# Altium project dxp.PrjPcb (part 2 of 2)

## Sheet DRV8313EVM.SchDoc
size A4
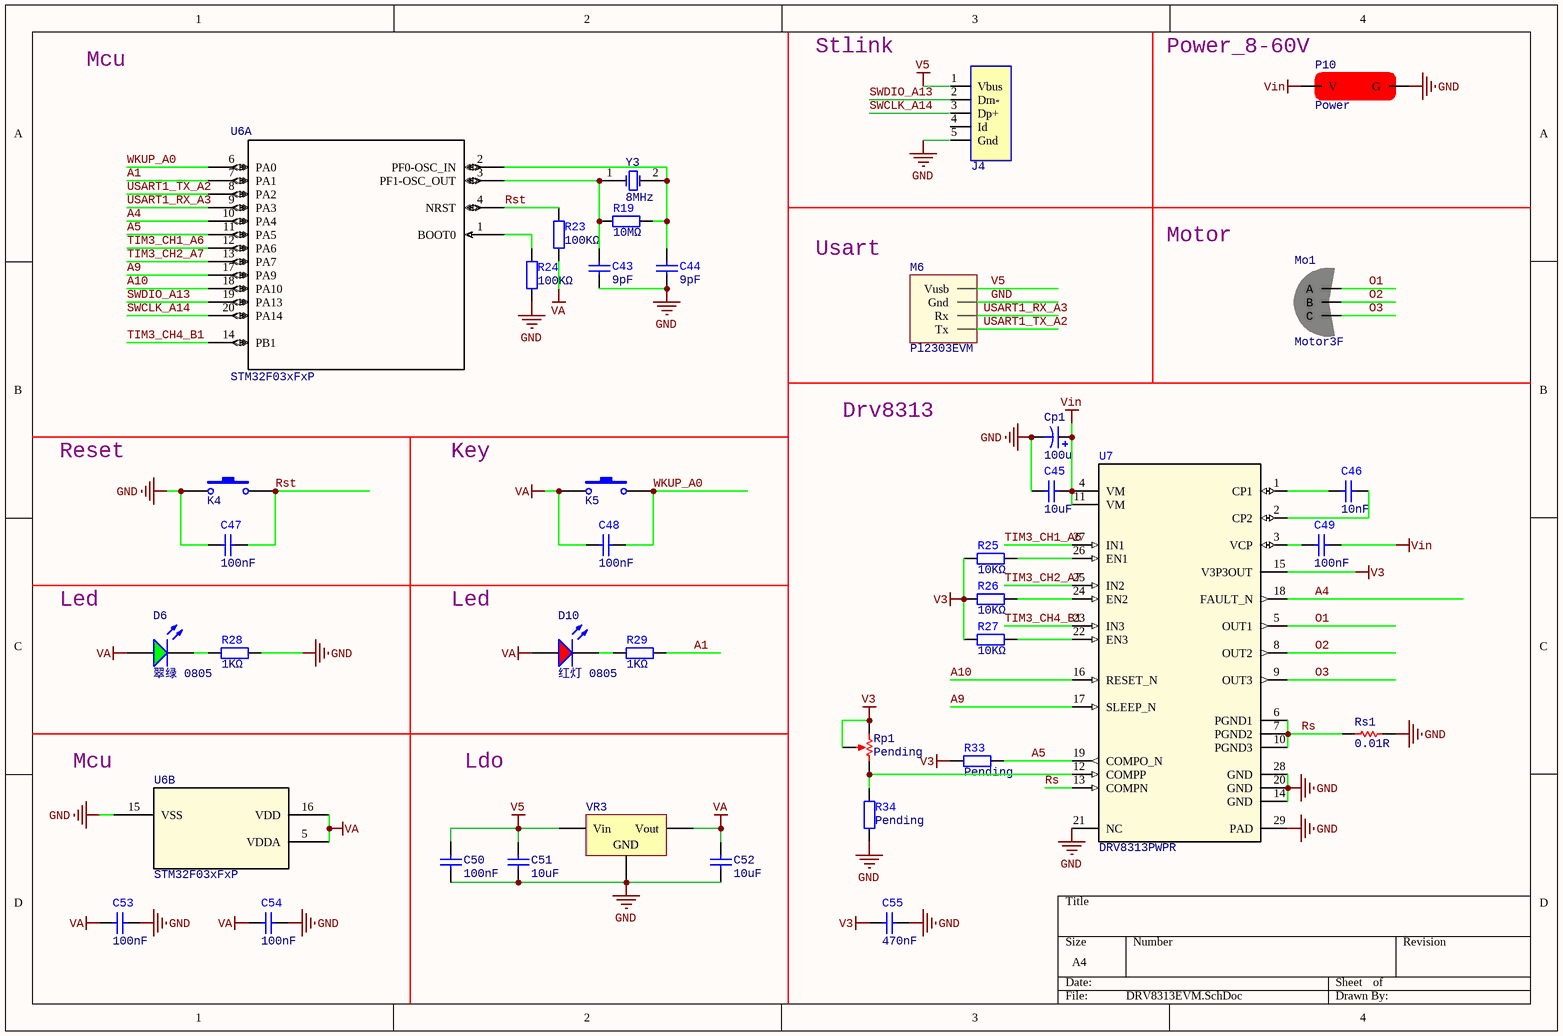
[diagram p8: DRV8313EVM.SchDoc]

### Parts
(Parts that share a designator on the sheet are numbered #1, #2 ... from top to bottom, then left to right.)
C43  9pF  [0805_C]
C44  9pF  [0805_C]
C45  10uF  [0805_C]
C46  10nF  [0805_C]
C47  100nF  [0805_C]
C48  100nF  [0805_C]
C49  100nF  [0805_C]
C50  100nF  [0805_C]
C51  10uF  [0805_C]
C52  10uF  [0805_C]
C53  100nF  [0805_C]
C54  100nF  [0805_C]
C55  470nF  [0805_C]
Cp1  100u  [CM D(6.3*5.4)]
D6  翠绿 0805  [0805_LED_S1]
D10  红灯 0805  [0805_LED_S1]
J4#2  UsbOtg  [USB-MINI-A]  (value not drawn)
K4  SW  [SWITCH]  (value not drawn)
K5  SW  [SWITCH]  (value not drawn)
M6#1  Pl2303EVM  [PI230203EVM]
Mo1  Motor3F  [Motor_3F]
P10  Power  [DC-005]
R19#2  10MΩ  [0805_R]
R23  100KΩ  [0805_R]
R24  100KΩ  [0805_R]
R25  10KΩ  [0805_R]
R26  10KΩ  [0805_R]
R27  10KΩ  [0805_R]
R28  1KΩ  [0805_R]
R29  1KΩ  [0805_R]
R33  Pending  [0805_R]
R34  Pending  [0805_R]
Rp1#1  Pending  [RP3362P]
Rs1#1  0.01R  [R 2512_L]
U6  STM32F03xFxP  [TSSOP20]  (parts A,B of 2)
U7  DRV8313PWPR  [PWP0028F_L]
VR3#1  AMS1117-3.3  [SOT-223]  (value not drawn)
Y3  8MHz  [XTAL_US]

### Nets
GND: C43.1 C44.1 C45.1 C47.2 C50.1 C51.1 C52.1 C53.1 C54.1 C55.2 Cp1.2 J4#2.5(Gnd) K4.1 M6#1.2(Gnd) P10.2(G) R24.1 R28.1 R34.1 Rs1#1.2 U6.15(VSS) U7.14(GND) U7.20(GND) U7.21(NC) U7.28(GND) U7.29(PAD) VR3#1.1(GND)
V3: C55.1 R25.1 R26.1 R27.1 R33.2 Rp1#1.2(TAP) Rp1#1.3(TOP) U7.15(V3P3OUT)
V5: C50.2 C51.2 J4#2.1(Vbus) M6#1.1(Vusb) VR3#1.3(Vin)
VA: C48.2 C52.2 C53.2 C54.2 D6.A D10.A K5.1 R23.1 U6.5(VDDA) U6.16(VDD) VR3#1.2(Vout)
Vin: C45.2 C49.2 Cp1.1 P10.1(V) U7.4(VM) U7.11(VM)
A1: R29.1 U6.7(PA1)
A4: U6.10(PA4) U7.18(FAULT_N)
A5: R33.1 U6.11(PA5) U7.19(COMPO_N)
A9: U6.17(PA9) U7.17(SLEEP_N)
A10: U6.18(PA10) U7.16(RESET_N)
O1: Mo1.1(A) U7.5(OUT1)
O2: Mo1.2(B) U7.8(OUT2)
O3: Mo1.3(C) U7.9(OUT3)
Rs: Rs1#1.1 U7.6(PGND1) U7.7(PGND2) U7.10(PGND3) U7.13(COMPN)
Rst: C47.1 K4.2 R23.2 U6.4(NRST)
SWCLK_A14: J4#2.3(Dp+) U6.20(PA14)
SWDIO_A13: J4#2.2(Dm-) U6.19(PA13)
TIM3_CH1_A6: U6.12(PA6) U7.27(IN1)
TIM3_CH2_A7: U6.13(PA7) U7.25(IN2)
TIM3_CH4_B1: U6.14(PB1) U7.23(IN3)
USART1_RX_A3: M6#1.3(Rx) U6.9(PA3)
USART1_TX_A2: M6#1.4(Tx) U6.8(PA2)
WKUP_A0: C48.1 K5.2 U6.6(PA0)
NetC43_2: C43.2 R19#2.1 U6.3(PF1-OSC_OUT) Y3.1(OSC1)
NetC44_2: C44.2 R19#2.2 U6.2(PF0-OSC_IN) Y3.2(OSC2)
NetC46_1: C46.1 U7.1(CP1)
NetC46_2: C46.2 U7.2(CP2)
NetC49_1: C49.1 U7.3(VCP)
NetD6_K: D6.K R28.2
NetD10_K: D10.K R29.2
NetR24_2: R24.2 U6.1(BOOT0)
NetR25_2: R25.2 U7.26(EN1)
NetR26_2: R26.2 U7.24(EN2)
NetR27_2: R27.2 U7.22(EN3)
NetR34_2: R34.2 Rp1#1.1(BOT) U7.12(COMPP)

Not connected (* = marked no-connect by the designer): J4#2 4(Id)

### Notes on the sheet
- Mcu
- Stlink
- (near P10) Power_8-60V
- Motor
- Usart
- Drv8313
- Reset
- Key
- Led
- Ldo

### Library data of the parts
C43-C49 C53-C55 = 0805 10nF (103) 10% 50V: 贴片电容; ComponentLink1Description: 供应商链接; ComponentLink1URL: http://www.szlcsc.com/product/details_2062.html; Package: 0805; Supplier: LC; SuppliersPartNumber: C1710
C50-C52 = 0805 10uF (106) 10% 25V: 贴片电容; ComponentLink1Description: 供应商链接; ComponentLink1URL: http://www.szlcsc.com/product/details_16532.html; Package: 0805; Supplier: LC; SuppliersPartNumber: C15850
Cp1 = Cp: Polarized Capacitor (Axial); Published: 8-Jun-2000; LatestRevisionDate: 17-Jul-2002; LatestRevisionNote: Re-released for DXP Platform.; PackageReference: POLAR0.8; Publisher: Altium Limited; PackageDescription: Polarized Capacitor; 2 Leads
D6 = 0805 翠绿: 发光二极管; ComponentLink1Description: 供应商链接; ComponentLink1URL: http://www.szlcsc.com/product/details_2670.html; Package: 0805; Supplier: LC; SuppliersPartNumber: C2297
D10 = 0805 红灯: 发光二极管; ComponentLink1Description: 供应商链接; ComponentLink1URL: http://www.szlcsc.com/product/details_2668.html; Package: 0805; Supplier: LC; SuppliersPartNumber: C2295
K4 K5 = SW: Switch
R19#2 R23-R29 R33 R34 = 0805 10KΩ (1002) 1%: 贴片电阻; ComponentLink1Description: 供应商链接; ComponentLink1URL: http://www.szlcsc.com/product/details_18102.html; Package: 0805; Supplier: LC; SuppliersPartNumber: C17414
Rp1#1 = Rp: Potentiometer; Sim Note: Enter the Resistance value and the set point into parameter fields.; Set Position: 0.5; Published: 8-Jun-2000; LatestRevisionDate: 17-Jul-2002; LatestRevisionNote: Re-released for DXP Platform.; PackageReference: VR5; Publisher: Altium Limited; PackageDescription: Variable Resistor, Thru-Hole; 3 Leads
Rs1#1 = Rs
U6 = STM32F03xFxP: Mcu; Vendor: STMicroelectronics; C: Copyright (C) 2016 Accelerated Designs. All rights reserved; Copyright: Copyright (C) 2016 Accelerated Designs. All rights reserved; Manufacturer_Part_Number: stm32f03xfxp; RefDes: RefDes; Type: Type; Value: Value
U7 = DRV8313PWPR: Imported; Manufacturer: Texas Instruments; PartNumber: DRV8313PWPR; RefDes: RefDes; TYPE: TYPE; Value: Value
VR3#1 = SOT-223 AMS1117-3.3: 低压差线性稳压(LDO); ComponentLink1Description: 供应商链接; ComponentLink1URL: http://www.szlcsc.com/product/details_6652.html; Package: SOT-223; Supplier: LC; SuppliersPartNumber: C6186
Y3 = XTAL: Crystal Oscillator; Published: 8-Jun-2000; LatestRevisionDate: 17-Jul-2002; LatestRevisionNote: Re-released for DXP Platform.; Publisher: Altium Limited

## Sheet MPU6050EVM.SchDoc
size A4
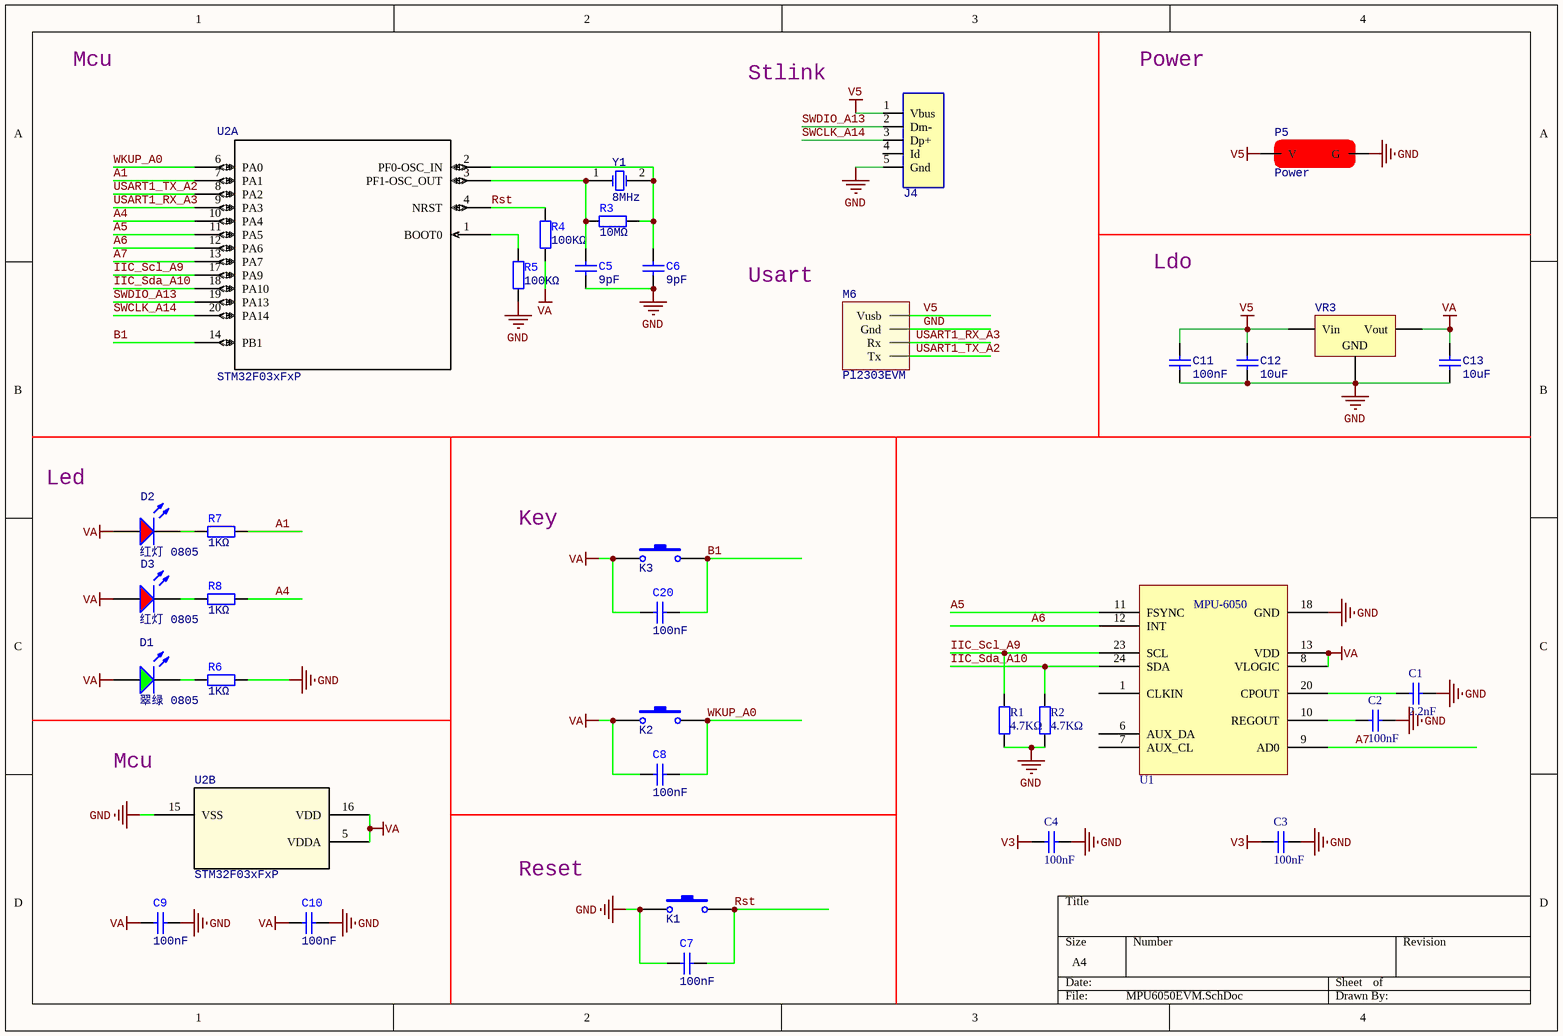
[diagram p9: MPU6050EVM.SchDoc]

### Parts
(Parts that share a designator on the sheet are numbered #1, #2 ... from top to bottom, then left to right.)
C1#7  2.2nF  [0805_C]
C2#8  100nF  [0805_C]
C3#7  100nF  [0805_C]
C4#7  100nF  [0805_C]
C5#5  9pF  [0805_C]
C6#5  9pF  [0805_C]
C7#5  100nF  [0805_C]
C8#5  100nF  [0805_C]
C9#4  100nF  [0805_C]
C10#4  100nF  [0805_C]
C11#4  100nF  [0805_C]
C12#4  10uF  [0805_C]
C13#4  10uF  [0805_C]
C20#2  100nF  [0805_C]
D1#6  翠绿 0805  [0805_LED_S1]
D2#4  红灯 0805  [0805_LED_S1]
D3#2  红灯 0805  [0805_LED_S1]
J4#3  UsbOtg  [USB-MINI-A]  (value not drawn)
K1#2  SW  [SWITCH]  (value not drawn)
K2#2  SW  [SWITCH]  (value not drawn)
K3#2  SW  [SWITCH]  (value not drawn)
M6#2  Pl2303EVM  [PI230203EVM]
P5#2  Power  [DC-005]
R1#7  4.7KΩ  [0805_R]
R2#6  4.7KΩ  [0805_R]
R3#6  10MΩ  [0805_R]
R4#6  100KΩ  [0805_R]
R5#5  100KΩ  [0805_R]
R6#4  1KΩ  [0805_R]
R7#3  1KΩ  [0805_R]
R8#4  1KΩ  [0805_R]
U1#7  MPU6050  [QFN24 4x4_L]  (value not drawn)
U2#7  STM32F03xFxP  [TSSOP20]  (parts A,B of 2)
VR3#2  AMS1117-3.3  [SOT-223]  (value not drawn)
Y1#5  8MHz  [XTAL_US]

### Nets
GND: C1#7.2 C2#8.1 C3#7.2 C4#7.2 C5#5.1 C6#5.1 C7#5.2 C9#4.1 C10#4.1 C11#4.1 C12#4.1 C13#4.1 J4#3.5(Gnd) K1#2.1 M6#2.2(Gnd) P5#2.2(G) R1#7.1 R2#6.1 R5#5.1 R6#4.1 U1#7.18(GND) U2#7.15(VSS) VR3#2.1(GND)
V3: C3#7.1 C4#7.1
V5: C11#4.2 C12#4.2 J4#3.1(Vbus) M6#2.1(Vusb) P5#2.1(V) VR3#2.3(Vin)
VA: C8#5.2 C9#4.2 C10#4.2 C13#4.2 C20#2.2 D1#6.A D2#4.A D3#2.A K2#2.1 K3#2.1 R4#6.1 U1#7.8(VLOGIC) U1#7.13(VDD) U2#7.5(VDDA) U2#7.16(VDD) VR3#2.2(Vout)
A1: R7#3.1 U2#7.7(PA1)
A4: R8#4.1 U2#7.10(PA4)
A5: U1#7.11(FSYNC) U2#7.11(PA5)
A6: U1#7.12(INT) U2#7.12(PA6)
A7: U1#7.9(AD0) U2#7.13(PA7)
B1: C20#2.1 K3#2.2 U2#7.14(PB1)
IIC_Scl_A9: R1#7.2 U1#7.23(SCL) U2#7.17(PA9)
IIC_Sda_A10: R2#6.2 U1#7.24(SDA) U2#7.18(PA10)
Rst: C7#5.1 K1#2.2 R4#6.2 U2#7.4(NRST)
SWCLK_A14: J4#3.3(Dp+) U2#7.20(PA14)
SWDIO_A13: J4#3.2(Dm-) U2#7.19(PA13)
USART1_RX_A3: M6#2.3(Rx) U2#7.9(PA3)
USART1_TX_A2: M6#2.4(Tx) U2#7.8(PA2)
WKUP_A0: C8#5.1 K2#2.2 U2#7.6(PA0)
NetC1#7_1: C1#7.1 U1#7.20(CPOUT)
NetC2#8_2: C2#8.2 U1#7.10(REGOUT)
NetC5#5_2: C5#5.2 R3#6.1 U2#7.3(PF1-OSC_OUT) Y1#5.1(OSC1)
NetC6#5_2: C6#5.2 R3#6.2 U2#7.2(PF0-OSC_IN) Y1#5.2(OSC2)
NetD1#6_K: D1#6.K R6#4.2
NetD2#4_K: D2#4.K R7#3.2
NetD3#2_K: D3#2.K R8#4.2
NetR5#5_2: R5#5.2 U2#7.1(BOOT0)

Not connected (* = marked no-connect by the designer): J4#3 4(Id); U1#7 1(CLKIN) 6(AUX_DA) 7(AUX_CL)

### Notes on the sheet
- Mcu
- Stlink
- Power
- Usart
- Ldo
- Led
- Key
- Reset
- (in symbol MPU6050) MPU-6050

### Library data of the parts
C1#7 C2#8 C3#7 C4#7 = 0805 2.2nF (222) 5% 50V: 贴片电容; ComponentLink1Description: 供应商链接; ComponentLink1URL: http://www.szlcsc.com/product/details_29010.html; Package: 0805; Supplier: LC; SuppliersPartNumber: C28260
C5#5 C6#5 C7#5 C8#5 C9#4 C10#4 C20#2 = 0805 10nF (103) 10% 50V: 贴片电容; ComponentLink1Description: 供应商链接; ComponentLink1URL: http://www.szlcsc.com/product/details_2062.html; Package: 0805; Supplier: LC; SuppliersPartNumber: C1710
C11#4 C12#4 C13#4 = 0805 10uF (106) 10% 25V: 贴片电容; ComponentLink1Description: 供应商链接; ComponentLink1URL: http://www.szlcsc.com/product/details_16532.html; Package: 0805; Supplier: LC; SuppliersPartNumber: C15850
D1#6 = 0805 翠绿: 发光二极管; ComponentLink1Description: 供应商链接; ComponentLink1URL: http://www.szlcsc.com/product/details_2670.html; Package: 0805; Supplier: LC; SuppliersPartNumber: C2297
D2#4 D3#2 = 0805 红灯: 发光二极管; ComponentLink1Description: 供应商链接; ComponentLink1URL: http://www.szlcsc.com/product/details_2668.html; Package: 0805; Supplier: LC; SuppliersPartNumber: C2295
K1#2 K2#2 K3#2 = SW: Switch
R1#7 R2#6 = 0805 4.7KΩ (4701) 1%: 贴片电阻; ComponentLink1Description: 供应商链接; ComponentLink1URL: http://www.szlcsc.com/product/details_18361.html; Package: 0805; Supplier: LC; SuppliersPartNumber: C17673
R3#6 R4#6 R5#5 R6#4 R7#3 R8#4 = 0805 10KΩ (1002) 1%: 贴片电阻; ComponentLink1Description: 供应商链接; ComponentLink1URL: http://www.szlcsc.com/product/details_18102.html; Package: 0805; Supplier: LC; SuppliersPartNumber: C17414
U2#7 = STM32F03xFxP: as U6 on sheet DRV8313EVM; Copyright: Copyright (C) 2016 Accelerated Designs. All rights reserved; Manufacturer_Part_Number: stm32f03xfxp; RefDes: RefDes; Type: Type; Value: Value
VR3#2 = SOT-223 AMS1117-3.3: 低压差线性稳压(LDO); ComponentLink1Description: 供应商链接; ComponentLink1URL: http://www.szlcsc.com/product/details_6652.html; Package: SOT-223; Supplier: LC; SuppliersPartNumber: C6186
Y1#5 = XTAL: Crystal Oscillator; Published: 8-Jun-2000; LatestRevisionDate: 17-Jul-2002; LatestRevisionNote: Re-released for DXP Platform.; Publisher: Altium Limited

## Sheet MPU9250EVM.SchDoc
size A4

## Sheet LM2596MOD.SchDoc
size A4
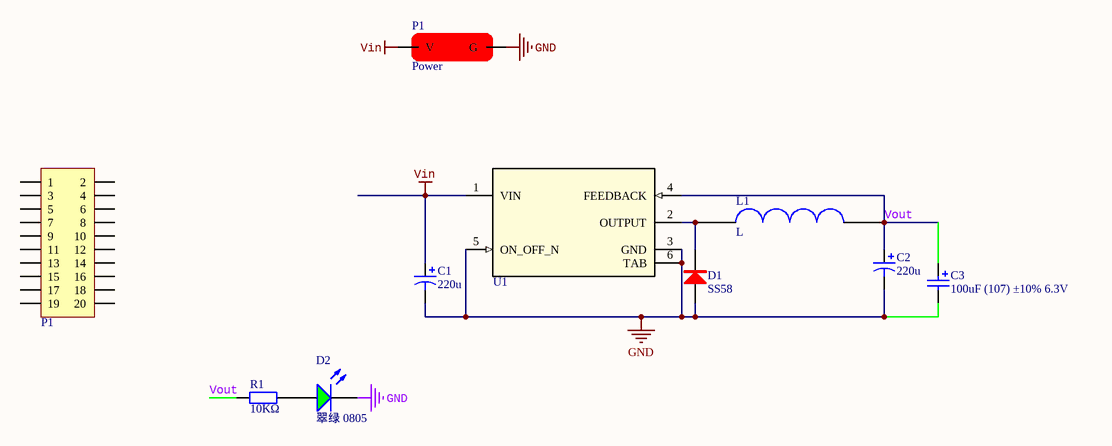
[diagram p10: LM2596MOD.SchDoc]

### Parts
(Parts that share a designator on the sheet are numbered #1, #2 ... from top to bottom, then left to right.)
C1#8  220u  [CM F(10*10.2)]
C2#9  220u  [CM F(10*10.2)]
C3#8  100uF (107) ±10% 6.3V  [CASE-B_3528]
D1#7  SS58  [SMA]
D2#5  翠绿 0805  [0805_LED_S1]
L1#2  L  [CDRH127]
P1#4  Power  [DC-005]
P1#5  Header 2X10  [TB2.54 10x2]  (value not drawn)
R1#8  10KΩ  [0805_R]
U1#8  LM2596  [TO263]  (value not drawn)

### Nets
GND: C1#8.2 C2#9.2 C3#8.2 D1#7.1(A) D2#5.K P1#4.2(G) U1#8.3(GND) U1#8.5(ON_OFF_N) U1#8.6(TAB)
Vin: C1#8.1 P1#4.1(V) U1#8.1(VIN)
Vout: C2#9.1 C3#8.1 L1#2.2 R1#8.1 U1#8.4(FEEDBACK)
NetD1#7_2: D1#7.2(K) L1#2.1 U1#8.2(OUTPUT)
NetD2#5_A: D2#5.A R1#8.2

Not connected (* = marked no-connect by the designer): P1#5 1 2 3 4 5 6 7 8 9 10 11 12 13 14 15 16 17 18 19 20

### Library data of the parts
C1#8 C2#9 = Cp: Polarized Capacitor (Axial); Published: 8-Jun-2000; LatestRevisionDate: 17-Jul-2002; LatestRevisionNote: Re-released for DXP Platform.; PackageReference: POLAR0.8; Publisher: Altium Limited; PackageDescription: Polarized Capacitor; 2 Leads
C3#8 = 3528 100uF (107) 10% 6.3V: 钽电容; ComponentLink1Description: 供应商链接; ComponentLink1URL: http://www.szlcsc.com/product/details_16815.html; Package: 3528; Supplier: LC; SuppliersPartNumber: C16133
D1#7 = Dz: 整流二极管; 版权归属: 源创客; BOM名称: 整流二极管; 学习资源: www.ooocke.com
D2#5 = 0805 翠绿: 发光二极管; ComponentLink1Description: 供应商链接; ComponentLink1URL: http://www.szlcsc.com/product/details_2670.html; Package: 0805; Supplier: LC; SuppliersPartNumber: C2297
P1#5 = Header 10X2: 10*2P接插件; 版权归属: 源创客; BOM名称: 10*2P接插件; 学习资源: www.ooocke.com
R1#8 = 0805 10KΩ (1002) 1%: 贴片电阻; ComponentLink1Description: 供应商链接; ComponentLink1URL: http://www.szlcsc.com/product/details_18102.html; Package: 0805; Supplier: LC; SuppliersPartNumber: C17414
U1#8 = LM2596: Imported; PartNumber: LM2596SX-ADJ/NOPB; Alternate_PartNumber: LM2596S-ADJ/NOPB; Manufacturer: Texas Instruments; CompType: IC; PIN_COUNT: 6; PackageReference: KTT0005B; MountType: SMT; RoHS: Y; RefDes: RefDes; TYPE: TYPE; Value: Value

## Sheet BQ34Z100EVM.SchDoc
size A4

## Sheet MainCtrl.SchDoc
size A3
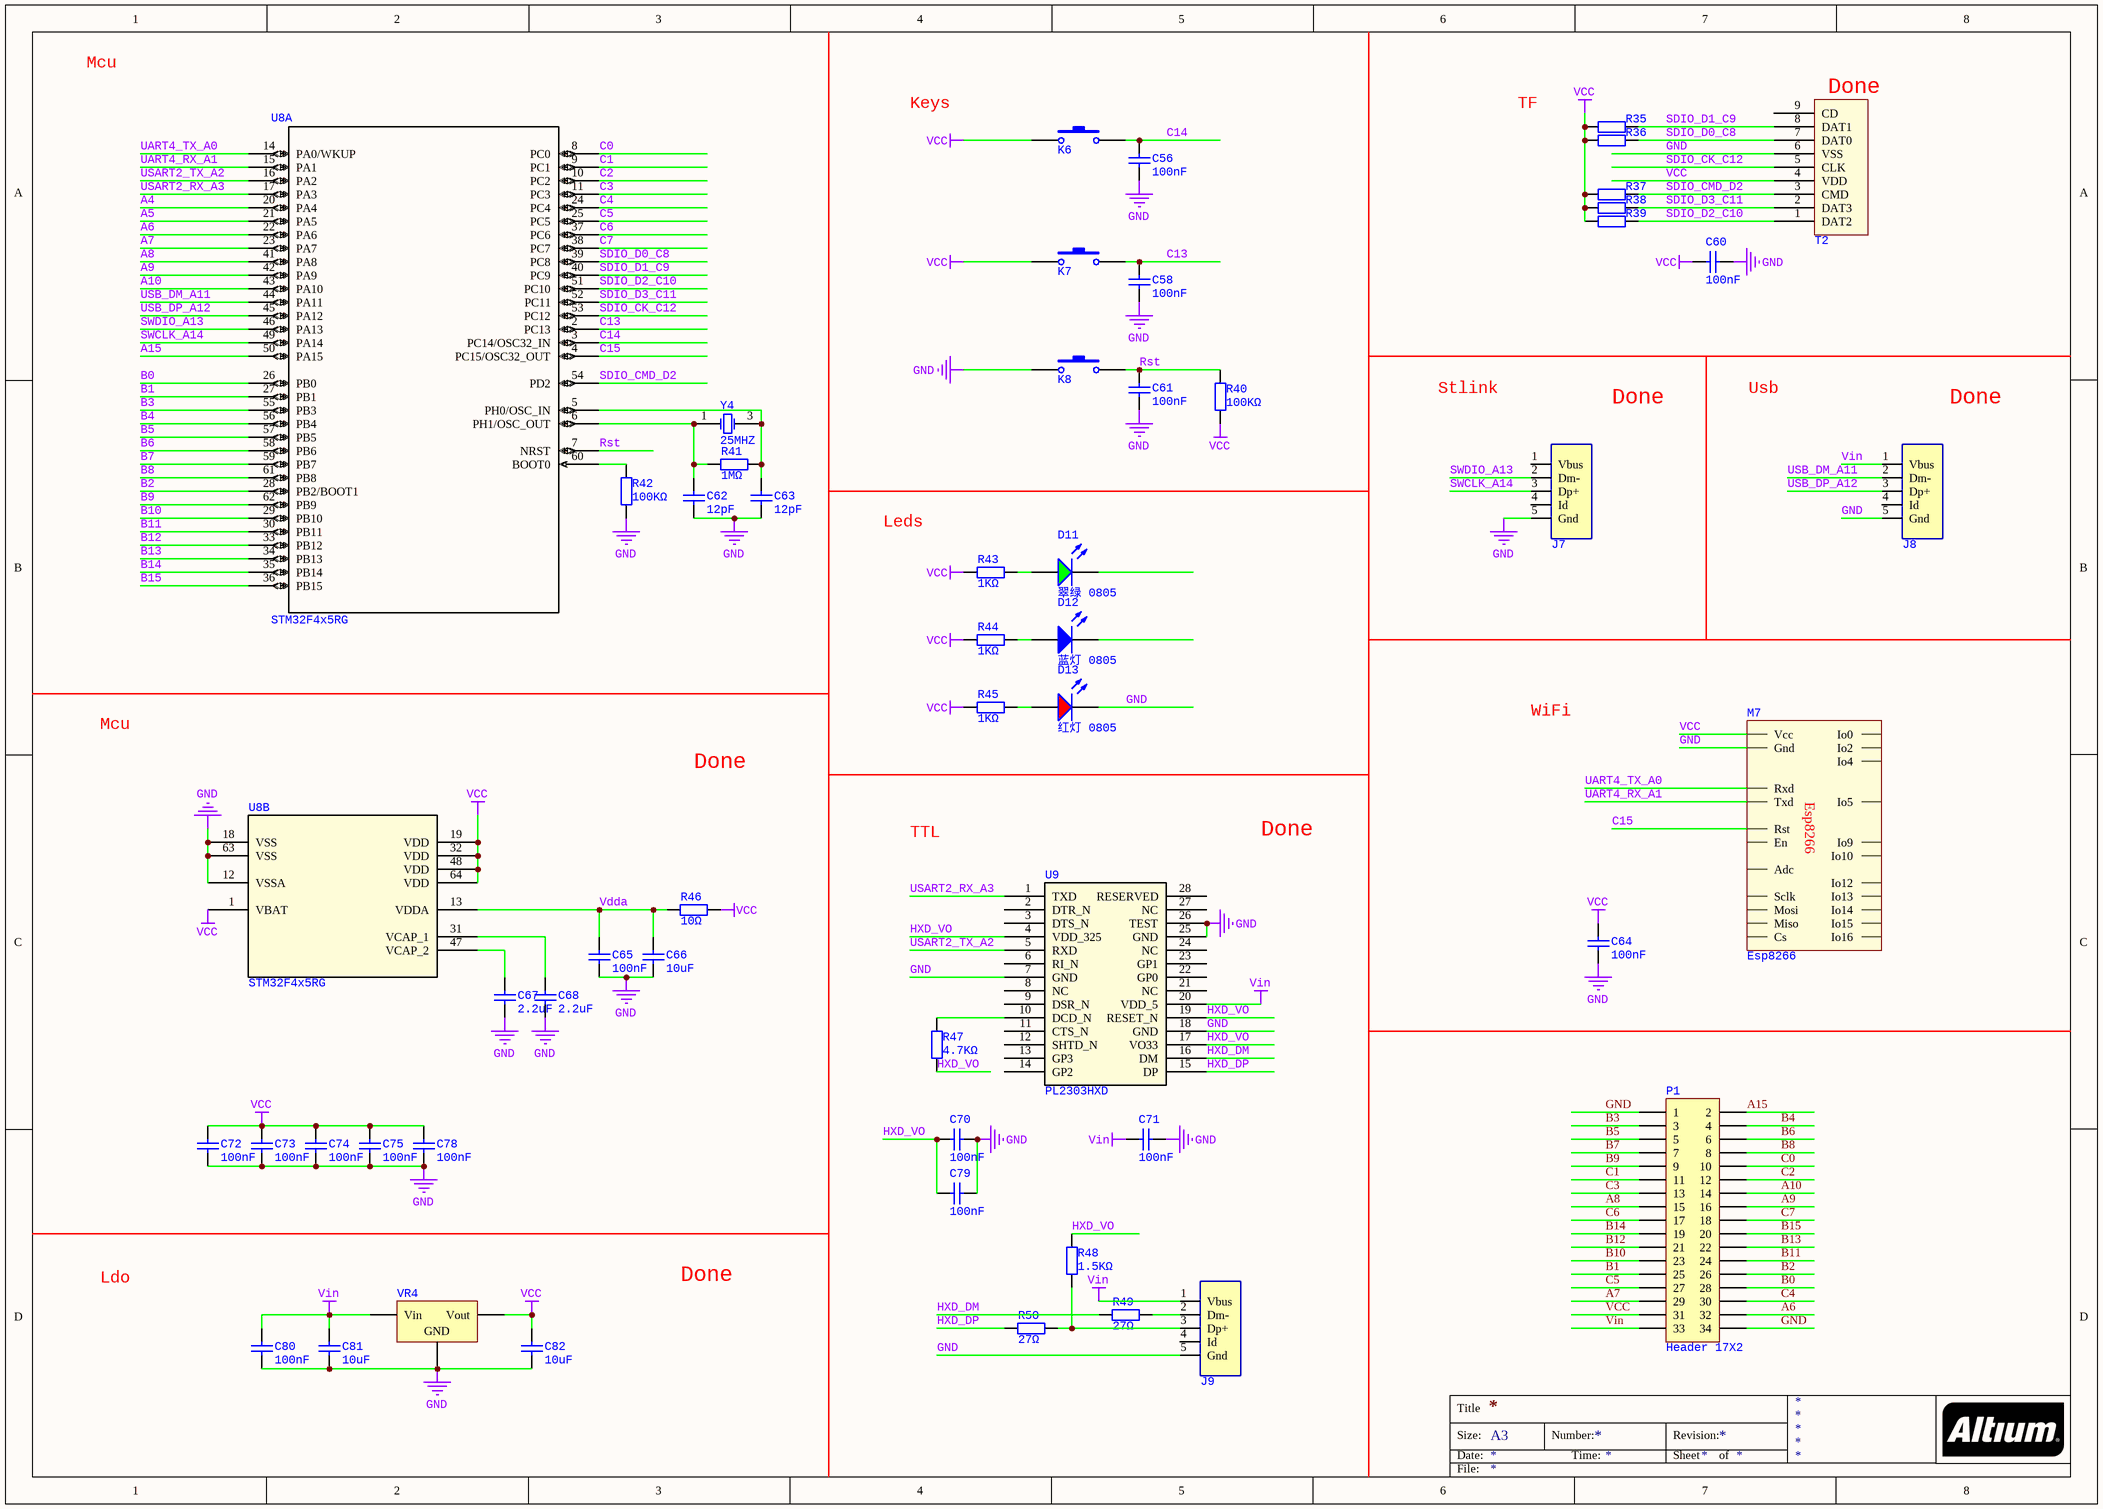
[diagram p11: MainCtrl.SchDoc]

### Parts
(Parts that share a designator on the sheet are numbered #1, #2 ... from top to bottom, then left to right.)
C56  100nF  [0603_C]
C58  100nF  [0603_C]
C60  100nF  [0603_C]
C61  100nF  [0603_C]
C62  12pF  [0603_C]
C63  12pF  [0603_C]
C64  100nF  [0603_C]
C65  100nF  [0603_C]
C66  10uF  [0603_C]
C67  2.2uF  [0603_C]
C68  2.2uF  [0603_C]
C70  100nF  [0603_C]
C71  100nF  [0603_C]
C72  100nF  [0603_C]
C73  100nF  [0603_C]
C74  100nF  [0603_C]
C75  100nF  [0603_C]
C78  100nF  [0603_C]
C79  100nF  [0603_C]
C80  100nF  [0603_C]
C81  10uF  [0805_C]
C82  10uF  [0805_C]
D11  翠绿 0805  [0805_LED_S1]
D12  蓝灯 0805  [0805_LED_S1]
D13  红灯 0805  [0805_LED_S1]
J7  UsbOtg  [USB-MINI-A]  (value not drawn)
J8  UsbOtg  [USB-MICRO_E]  (value not drawn)
J9  UsbOtg  [USB-MICRO_E]  (value not drawn)
K6  SW  [SWITCH]  (value not drawn)
K7  SW  [SWITCH]  (value not drawn)
K8  SW  [SWITCH]  (value not drawn)
M7#1  Esp8266  [ESP8266]
P1#6  Header 17X2  [P17X2]
R35  47KΩ  [0603_R]  (value not drawn)
R36  47KΩ  [0603_R]  (value not drawn)
R37  47KΩ  [0603_R]  (value not drawn)
R38  47KΩ  [0603_R]  (value not drawn)
R39  47KΩ  [0603_R]  (value not drawn)
R40  100KΩ  [0603_R]
R41  1MΩ  [0603_R]
R42  100KΩ  [0603_R]
R43  1KΩ  [0603_R]
R44  1KΩ  [0603_R]
R45  1KΩ  [0603_R]
R46  10Ω  [0603_R]
R47  4.7KΩ  [0603_R]
R48  1.5KΩ  [0603_R]
R49  27Ω  [0603_R]
R50  27Ω  [0603_R]
T2  TFCard  [TF-CARD]  (value not drawn)
U8  STM32F4x5RG  [LQFP64]  (parts A,B of 2)
U9  PL2303HXD  [SSOP28]
VR4  AMS1117-3.3  [SOT-223]  (value not drawn)
Y4  25MHZ  [SMD-3225_4P]

### Nets
GND: C56.1 C58.1 C60.2 C61.1 C62.1 C63.1 C64.1 C65.1 C66.1 C67.1 C68.1 C70.1 C71.1 C72.1 C73.1 C74.1 C75.1 C78.1 C79.1 C80.1 C81.1 C82.1 D13.K J7.5(Gnd) J8.5(Gnd) J9.5(Gnd) K8.1 M7#1.15(Gnd) P1#6.1 P1#6.34 R42.1 T2.6(VSS) U8.12(VSSA) U8.18(VSS) U8.63(VSS) U9.7(GND) U9.18(GND) U9.25(GND) U9.26(TEST) VR4.1(GND)
VCC: C60.1 C64.2 C72.2 C73.2 C74.2 C75.2 C78.2 C82.2 K6.1 K7.1 M7#1.8(Vcc) P1#6.31 R35.1 R36.1 R37.1 R38.1 R39.1 R40.1 R43.2 R44.2 R45.2 R46.2 T2.4(VDD) U8.1(VBAT) U8.19(VDD) U8.32(VDD) U8.48(VDD) U8.64(VDD) VR4.2(Vout)
Vin: C71.2 C80.2 C81.2 J8.1(Vbus) J9.1(Vbus) P1#6.33 U9.20(VDD_5) VR4.3(Vin)
A4: U8.20(PA4)
A5: U8.21(PA5)
A6: P1#6.32 U8.22(PA6)
A7: P1#6.29 U8.23(PA7)
A8: P1#6.15 U8.41(PA8)
A9: P1#6.16 U8.42(PA9)
A10: P1#6.14 U8.43(PA10)
A15: P1#6.2 U8.50(PA15)
B0: P1#6.28 U8.26(PB0)
B1: P1#6.25 U8.27(PB1)
B2: P1#6.26 U8.28(PB2/BOOT1)
B3: P1#6.3 U8.55(PB3)
B4: P1#6.4 U8.56(PB4)
B5: P1#6.5 U8.57(PB5)
B6: P1#6.6 U8.58(PB6)
B7: P1#6.7 U8.59(PB7)
B8: P1#6.8 U8.61(PB8)
B9: P1#6.9 U8.62(PB9)
B10: P1#6.23 U8.29(PB10)
B11: P1#6.24 U8.30(PB11)
B12: P1#6.21 U8.33(PB12)
B13: P1#6.22 U8.34(PB13)
B14: P1#6.19 U8.35(PB14)
B15: P1#6.20 U8.36(PB15)
C0: P1#6.10 U8.8(PC0)
C1: P1#6.11 U8.9(PC1)
C2: P1#6.12 U8.10(PC2)
C3: P1#6.13 U8.11(PC3)
C4: P1#6.30 U8.24(PC4)
C5: P1#6.27 U8.25(PC5)
C6: P1#6.17 U8.37(PC6)
C7: P1#6.18 U8.38(PC7)
C13: C58.2 K7.2 U8.2(PC13)
C14: C56.2 K6.2 U8.3(PC14/OSC32_IN)
C15: M7#1.1(Rst) U8.4(PC15/OSC32_OUT)
HXD_DM: R49.1 U9.16(DM)
HXD_DP: R50.1 U9.15(DP)
HXD_VO: C70.2 C79.2 R47.2 R48.2 U9.4(VDD_325) U9.17(VO33) U9.19(RESET_N)
Rst: C61.2 K8.2 R40.2 U8.7(NRST)
SDIO_CK_C12: T2.5(CLK) U8.53(PC12)
SDIO_CMD_D2: R37.2 T2.3(CMD) U8.54(PD2)
SDIO_D0_C8: R36.2 T2.7(DAT0) U8.39(PC8)
SDIO_D1_C9: R35.2 T2.8(DAT1) U8.40(PC9)
SDIO_D2_C10: R39.2 T2.1(DAT2) U8.51(PC10)
SDIO_D3_C11: R38.2 T2.2(DAT3) U8.52(PC11)
SWCLK_A14: J7.3(Dp+) U8.49(PA14)
SWDIO_A13: J7.2(Dm-) U8.46(PA13)
UART4_RX_A1: M7#1.22(Txd) U8.15(PA1)
UART4_TX_A0: M7#1.21(Rxd) U8.14(PA0/WKUP)
USART2_RX_A3: U8.17(PA3) U9.1(TXD)
USART2_TX_A2: U8.16(PA2) U9.5(RXD)
USB_DM_A11: J8.2(Dm-) U8.44(PA11)
USB_DP_A12: J8.3(Dp+) U8.45(PA12)
Vdda: C65.2 C66.2 R46.1 U8.13(VDDA)
NetC62_2: C62.2 R41.1 U8.6(PH1/OSC_OUT) Y4.1(OSC1)
NetC63_2: C63.2 R41.2 U8.5(PH0/OSC_IN) Y4.3(OSC2)
NetC67_2: C67.2 U8.47(VCAP_2)
NetC68_2: C68.2 U8.31(VCAP_1)
NetD11_A: D11.A R43.1
NetD12_A: D12.A R44.1
NetD13_A: D13.A R45.1
NetJ9_2: J9.2(Dm-) R49.2
NetJ9_3: J9.3(Dp+) R48.1 R50.2
NetR42_2: R42.2 U8.60(BOOT0)
NetR47_1: R47.1 U9.10(DCD_N)

Not connected (* = marked no-connect by the designer): D11 K; D12 K; J7 1(Vbus) 4(Id); J8 4(Id); J9 4(Id); M7#1 2(Adc) 3(En) 4(Io16) 5(Io14) 6(Io12) 7(Io13) 9(Sclk) 10(Mosi) 11(Io10) 12(Io9) 13(Miso) 14(Cs) 16(Io15) 17(Io2) 18(Io0) 19(Io4) 20(Io5); T2 9(CD); U9 2(DTR_N) 3(DTS_N) 6(RI_N) 8(NC) 9(DSR_N) 11(CTS_N) 12(SHTD_N) 13(GP3) 14(GP2) 21(NC) 22(GP0) 23(GP1) 24(NC) 27(NC) 28(RESERVED)

### Notes on the sheet
- Mcu
- Keys
- TF
- (near T2) Done
- Stlink
- Done
- Usb
- Leds
- WiFi
- TTL
- Ldo
- Title
- Size:
- Date:
- A3
- Number:
- Time:
- Revision:
- Sheet
- of
- File:

### Library data of the parts
C56 C58 C60 C61 C64 C65 C70-C75 C78-C80 = 0603 100nF (104) 10% 50V: 贴片电容; ComponentLink1Description: 供应商链接; ComponentLink1URL: http://www.szlcsc.com/product/details_15331.html; Package: 0603; Supplier: LC; SuppliersPartNumber: C14663
C62 C63 = 0603 12pF (120) 5% 50V: 贴片电容; ComponentLink1Description: 供应商链接; ComponentLink1URL: http://www.szlcsc.com/product/details_39506.html; Package: 0603; Supplier: LC; SuppliersPartNumber: C38523
C66 = 0603 10uF (106) 10% 10V: 贴片电容; ComponentLink1Description: 供应商链接; ComponentLink1URL: http://www.szlcsc.com/product/details_20411.html; Package: 0603; Supplier: LC; SuppliersPartNumber: C19702
C67 C68 = 0603 2.2uF (225) 10% 16V: 贴片电容; ComponentLink1Description: 供应商链接; ComponentLink1URL: http://www.szlcsc.com/product/details_24366.html; Package: 0603; Supplier: LC; SuppliersPartNumber: C23630
C81 C82 = 0805 10uF (106) 10% 25V: 贴片电容; ComponentLink1Description: 供应商链接; ComponentLink1URL: http://www.szlcsc.com/product/details_16532.html; Package: 0805; Supplier: LC; SuppliersPartNumber: C15850
D11 = 0805 翠绿: 发光二极管; ComponentLink1Description: 供应商链接; ComponentLink1URL: http://www.szlcsc.com/product/details_2670.html; Package: 0805; Supplier: LC; SuppliersPartNumber: C2297
D12 = 0805 蓝灯: 发光二极管; ComponentLink1Description: 供应商链接; ComponentLink1URL: http://www.szlcsc.com/product/details_2666.html; Package: 0805; Supplier: LC; SuppliersPartNumber: C2293
D13 = 0805 红灯: 发光二极管; ComponentLink1Description: 供应商链接; ComponentLink1URL: http://www.szlcsc.com/product/details_2668.html; Package: 0805; Supplier: LC; SuppliersPartNumber: C2295
K6-K8 = SW: Switch
P1#6 = Header 17X2: Header, 17-Pin, Dual row; LatestRevisionDate: 17-Jul-2002; LatestRevisionNote: Re-released for DXP Platform.; Publisher: Altium Limited
R35-R39 = 0603 47KΩ (4702) 1%: 贴片电阻; ComponentLink1Description: 供应商链接; ComponentLink1URL: http://www.szlcsc.com/product/details_26562.html; Package: 0603; Supplier: LC; SuppliersPartNumber: C25819
R40 R42 = 0603 100KΩ (1003) 1%: 贴片电阻; ComponentLink1Description: 供应商链接; ComponentLink1URL: http://www.szlcsc.com/product/details_26546.html; Package: 0603; Supplier: LC; SuppliersPartNumber: C25803
R41 = 0603 1MΩ (1004) 1%: 贴片电阻; ComponentLink1Description: 供应商链接; ComponentLink1URL: http://www.szlcsc.com/product/details_23662.html; Package: 0603; Supplier: LC; SuppliersPartNumber: C22935
R43-R45 R47-R50 = 0603 10KΩ (1002) 1%: 贴片电阻; ComponentLink1Description: 供应商链接; ComponentLink1URL: http://www.szlcsc.com/product/details_26547.html; Package: 0603; Supplier: LC; SuppliersPartNumber: C25804
R46 = 0603 10Ω (10R0) 1%: 贴片电阻; ComponentLink1Description: 供应商链接; ComponentLink1URL: http://www.szlcsc.com/product/details_23586.html; Package: 0603; Supplier: LC; SuppliersPartNumber: C22859
U8 = STM32F4x5RG: Mcu; Vendor: STMicroelectronics; C: Copyright (C) 2016 Accelerated Designs. All rights reserved; Manufacturer_Part_Number: stm32f4x5rg; Copyright: Copyright (C) 2016 Accelerated Designs. All rights reserved; RefDes: RefDes; Type: Type; Value: Value
U9 = PL2303HXD: Driver; Manufacturer_Part_Number: tlc5916-q1_d_16; GENERIC_PART_NUMBER: TLC5916-Q1; Vendor: Texas Instruments; PACKAGE_DESIGNATOR: D; PIN_COUNT: 16; FAMILY_NAME: LED DRIVER; INDUSTRY_STD_PKG_TYPE: SOIC; Manufacturer: Texas Instruments; Datasheet_URL: http://www.ti.com/lit/gpn/TLC5916-Q1; Value: Value; Type: Type; RefDes: RefDes
VR4 = SOT-223 AMS1117-3.3: 低压差线性稳压(LDO); ComponentLink1Description: 供应商链接; ComponentLink1URL: http://www.szlcsc.com/product/details_6652.html; Package: SOT-223; Supplier: LC; SuppliersPartNumber: C6186
Y4 = SMD-3225_4P  25MHZ 12PF 10PPM: 贴片晶振; ComponentLink1Description: 供应商链接; ComponentLink1URL: http://www.szlcsc.com/product/details_9526.html; Package: SMD-3225_4P; Supplier: LC; SuppliersPartNumber: C9006

## Sheet DRV8711MOD.SchDoc
size A4
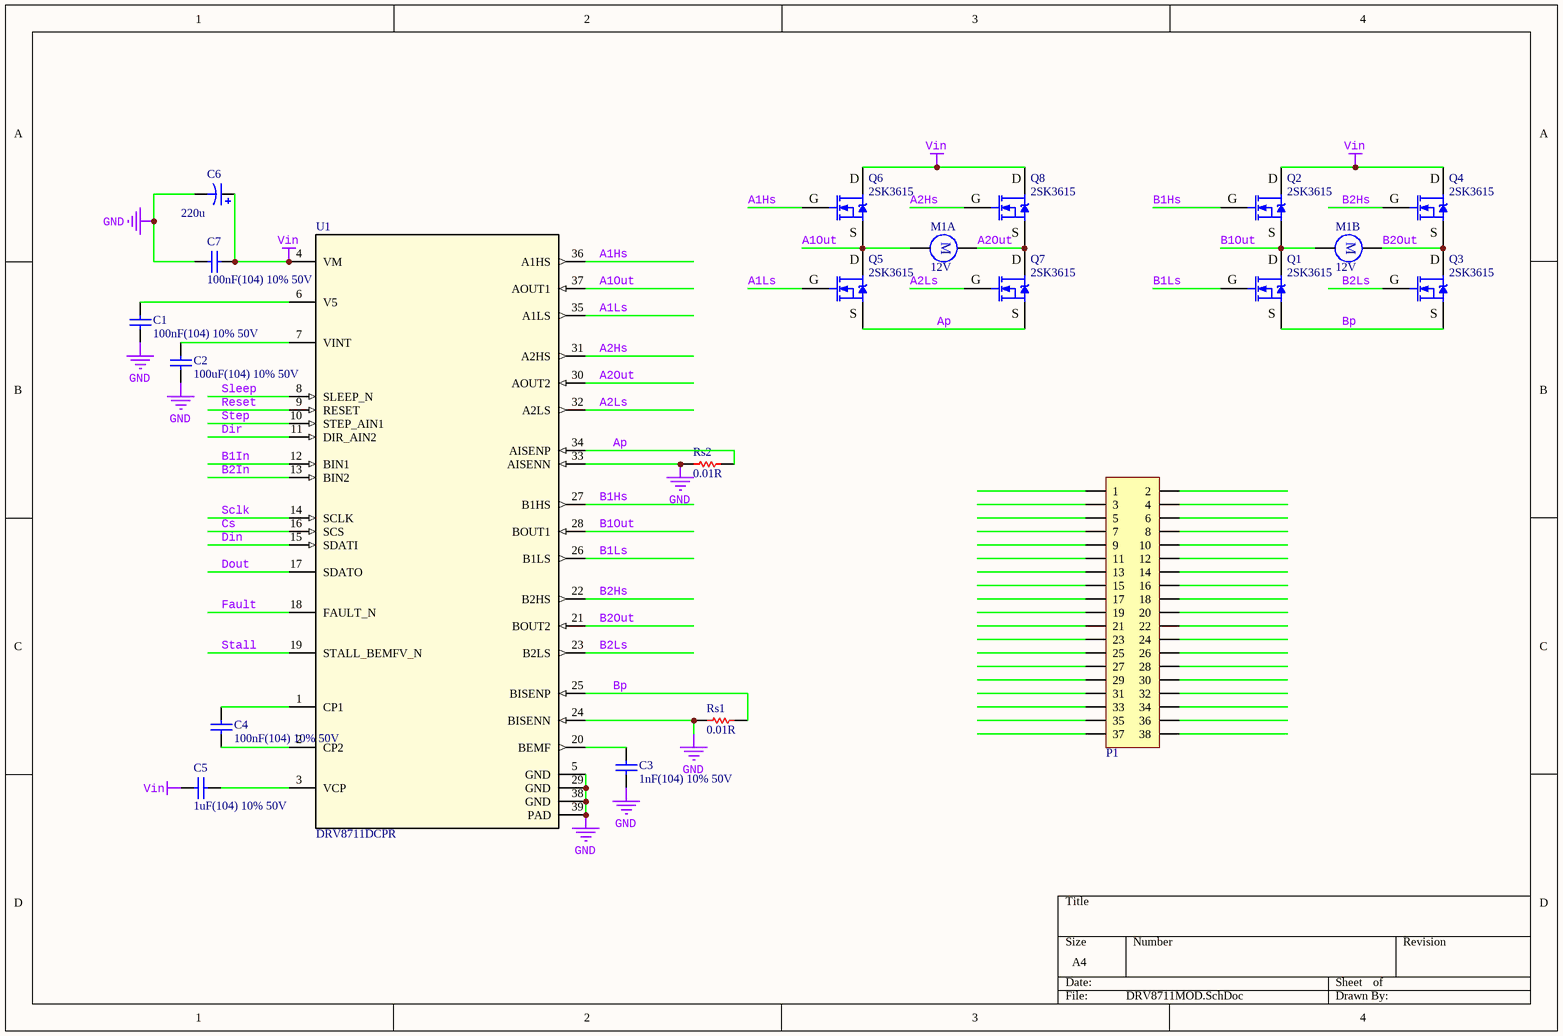
[diagram p12: DRV8711MOD.SchDoc]

### Parts
(Parts that share a designator on the sheet are numbered #1, #2 ... from top to bottom, then left to right.)
C1#9  100nF(104) 10% 50V  [0603_C]
C2#10  100uF(104) 10% 50V  [0603_C]
C3#9  1nF(104) 10% 50V  [0603_C]
C4#8  100nF(104) 10% 50V  [0603_C]
C5#6  1uF(104) 10% 50V  [0603_C]
C6#6  220u  [CM F(10*10.2)]
C7#6  100nF(104) 10% 50V  [0603_C]
M1#2  12V  [MotorStep]  (parts A,B of 2)
P1#7  Header 2X11  [TB2.54 19x2]  (value not drawn)
Q1#1  2SK3615  [IRF3205]
Q2  2SK3615  [IRF3205]
Q3  2SK3615  [IRF3205]
Q4  2SK3615  [IRF3205]
Q5  2SK3615  [IRF3205]
Q6  2SK3615  [IRF3205]
Q7  2SK3615  [IRF3205]
Q8  2SK3615  [IRF3205]
Rs1#2  0.01R  [R 2512_L]
Rs2  0.01R  [R 2512_L]
U1#9  DRV8711DCPR  [DCP0038A_L]

### Nets
GND: C1#9.1 C2#10.1 C3#9.1 C6#6.2 C7#6.2 Rs1#2.1 Rs2.1 U1#9.5(GND) U1#9.24(BISENN) U1#9.29(GND) U1#9.33(AISENN) U1#9.38(GND) U1#9.39(PAD)
Vin: C5#6.2 C6#6.1 C7#6.1 Q2.2(D) Q4.2(D) Q6.2(D) Q8.2(D) U1#9.4(VM)
A1Hs: Q6.1(G) U1#9.36(A1HS)
A1Ls: Q5.1(G) U1#9.35(A1LS)
A1Out: M1#2.2 Q5.2(D) Q6.3(S) U1#9.37(AOUT1)
A2Hs: Q8.1(G) U1#9.31(A2HS)
A2Ls: Q7.1(G) U1#9.32(A2LS)
A2Out: M1#2.1 Q7.2(D) Q8.3(S) U1#9.30(AOUT2)
Ap: Q5.3(S) Q7.3(S) Rs2.2 U1#9.34(AISENP)
B1Hs: Q2.1(G) U1#9.27(B1HS)
B1In: U1#9.12(BIN1)
B1Ls: Q1#1.1(G) U1#9.26(B1LS)
B1Out: M1#2.4 Q1#1.2(D) Q2.3(S) U1#9.28(BOUT1)
B2Hs: Q4.1(G) U1#9.22(B2HS)
B2In: U1#9.13(BIN2)
B2Ls: Q3.1(G) U1#9.23(B2LS)
B2Out: M1#2.3 Q3.2(D) Q4.3(S) U1#9.21(BOUT2)
Bp: Q1#1.3(S) Q3.3(S) Rs1#2.2 U1#9.25(BISENP)
Cs: U1#9.16(SCS)
Din: U1#9.15(SDATI)
Dir: U1#9.11(DIR_AIN2)
Dout: U1#9.17(SDATO)
Fault: U1#9.18(FAULT_N)
Reset: U1#9.9(RESET)
Sclk: U1#9.14(SCLK)
Sleep: U1#9.8(SLEEP_N)
Stall: U1#9.19(STALL_BEMFV_N)
Step: U1#9.10(STEP_AIN1)
NetC1#9_2: C1#9.2 U1#9.6(V5)
NetC2#10_2: C2#10.2 U1#9.7(VINT)
NetC3#9_2: C3#9.2 U1#9.20(BEMF)
NetC4#8_1: C4#8.1 U1#9.2(CP2)
NetC4#8_2: C4#8.2 U1#9.1(CP1)
NetC5#6_1: C5#6.1 U1#9.3(VCP)

Not connected (* = marked no-connect by the designer): P1#7 1 2 3 4 5 6 7 8 9 10 11 12 13 14 15 16 17 18 19 20 21 22 23 24 25 26 27 28 29 30 31 32 33 34 35 36 37 38

### Notes on the sheet
- (in symbol MotorStep, part A) M
- (in symbol MotorStep, part B) M

### Library data of the parts
C1#9 C2#10 C3#9 C4#8 C5#6 C7#6 = 0805 100nF(104) 10% 50V: 贴片电容; ComponentLink1Description: 供应商链接; ComponentLink1URL: http://www.szlcsc.com/product/details_50686.html; Package: 0805; Supplier: LC; SuppliersPartNumber: C49678
C6#6 = Cp: Polarized Capacitor (Axial); Published: 8-Jun-2000; LatestRevisionDate: 17-Jul-2002; LatestRevisionNote: Re-released for DXP Platform.; PackageReference: POLAR0.8; Publisher: Altium Limited; PackageDescription: Polarized Capacitor; 2 Leads
M1#2 = MotorStep: 直流电机; 版权归属: 源创客; BOM名称: 直流电机; 学习资源: www.ooocke.com
P1#7 = Header 19X2: 19*2P接插件; 版权归属: 源创客; BOM名称: 19*2P接插件; 学习资源: www.ooocke.com
Q1#1 Q2-Q8 = NMOS: N沟场效应管; 版权归属: 源创客; BOM名称: N沟场效应管; 学习资源: www.ooocke.com
Rs1#2 Rs2 = Rs
U1#9 = DRV8711DCPR: Imported; Manufacturer: Texas Instruments; PartNumber: DRV8711DCPR; RefDes: RefDes; TYPE: TYPE; Value: Value

## Sheet UCCMod.SchDoc
size A4
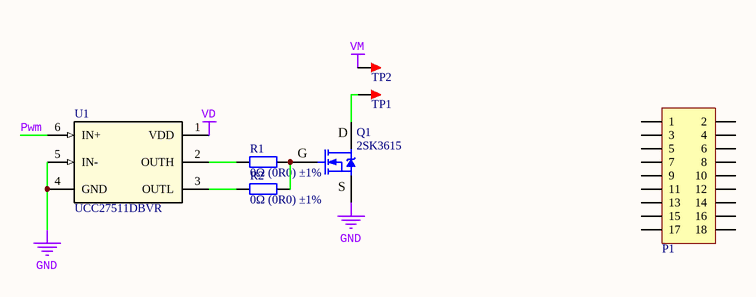
[diagram p13: UCCMod.SchDoc]

### Parts
(Parts that share a designator on the sheet are numbered #1, #2 ... from top to bottom, then left to right.)
P1#8  Header 9X2  [TB2.54 9x2]  (value not drawn)
Q1#2  2SK3615  [IRF3205]
R1#9  0Ω (0R0) ±1%  [0805_R]
R2#7  0Ω (0R0) ±1%  [0805_R]
TP1  TEST  [R50]  (value not drawn)
TP2  TEST  [R50]  (value not drawn)
U1#10  UCC27511DBVR  [DBV0006A_N]

### Nets
GND: Q1#2.3(S) U1#10.4(GND) U1#10.5(IN-)
VD: U1#10.1(VDD)
VM: TP2.1
Pwm: U1#10.6(IN+)
NetQ1#2_1: Q1#2.1(G) R1#9.2 R2#7.2
NetQ1#2_2: Q1#2.2(D) TP1.1
NetR1#9_1: R1#9.1 U1#10.2(OUTH)
NetR2#7_1: R2#7.1 U1#10.3(OUTL)

Not connected (* = marked no-connect by the designer): P1#8 1 2 3 4 5 6 7 8 9 10 11 12 13 14 15 16 17 18

### Notes on the sheet
- Title
- Size:
- Date:
- A4
- Number:
- Time:
- Revision:
- Sheet
- of
- File:

### Library data of the parts
P1#8 = Header 9X2: 9*2P接插件; 版权归属: 源创客; BOM名称: 9*2P接插件; 学习资源: www.ooocke.com
Q1#2 = NMOS: N沟场效应管; 版权归属: 源创客; BOM名称: N沟场效应管; 学习资源: www.ooocke.com
R1#9 R2#7 = 0805 0Ω (0R0) 1%: 贴片电阻; ComponentLink1Description: 供应商链接; ComponentLink1URL: http://www.szlcsc.com/product/details_18165.html; Package: 0805; Supplier: LC; SuppliersPartNumber: C17477
TP1 TP2 = TEST: 测试点; 版权归属: 源创客; BOM名称: 测试点; 学习资源: www.ooocke.com
U1#10 = UCC27511DBVR: Imported; Alternate_PartNumber: UCC27511DBVT; Manufacturer: Texas Instruments; CompType: IC; PIN_COUNT: 6; PartNumber: UCC27511DBVR; PackageReference: DBV0006A; MountType: SMT; RoHS: Y; RefDes: RefDes; TYPE: TYPE; Value: Value

## Sheet Opa365Mod.SchDoc
size A4
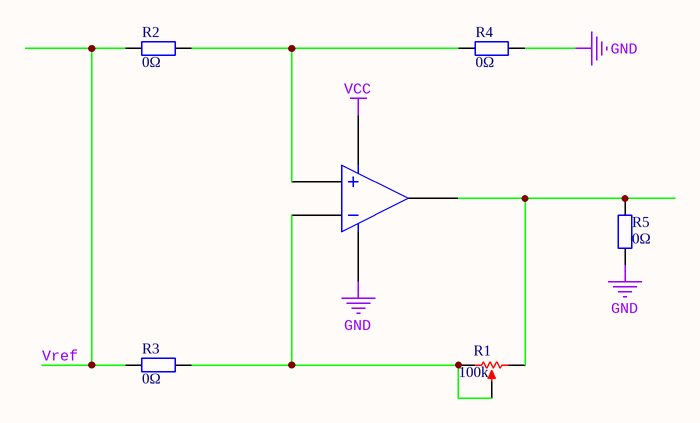
[diagram p14: Opa365Mod.SchDoc]

### Parts
(Parts that share a designator on the sheet are numbered #1, #2 ... from top to bottom, then left to right.)
R1#10  100k  [RP3362P]
R2#8  0Ω  [0805_R]
R3#7  0Ω  [0805_R]
R4#7  0Ω  [0805_R]
R5#6  0Ω  [0805_R]
U1#11  OPA365  [SO-8]  (value not drawn)

### Nets
GND: R4#7.2 R5#6.1 U1#11.4
VCC: U1#11.7
Vref: R2#8.1 R3#7.1
NetR1#10_1: R1#10.1(BOT) R5#6.2 U1#11.6
NetR1#10_2: R1#10.2(TAP) R1#10.3(TOP) R3#7.2 U1#11.2
NetR2#8_2: R2#8.2 R4#7.1 U1#11.3

### Library data of the parts
R1#10 = Rp: Potentiometer; Sim Note: Enter the Resistance value and the set point into parameter fields.; Set Position: 0.5; Published: 8-Jun-2000; LatestRevisionDate: 17-Jul-2002; LatestRevisionNote: Re-released for DXP Platform.; PackageReference: VR5; Publisher: Altium Limited; PackageDescription: Variable Resistor, Thru-Hole; 3 Leads
R2#8 R3#7 R4#7 R5#6 = 0805 0Ω (0R0) 1%: 贴片电阻; ComponentLink1Description: 供应商链接; ComponentLink1URL: http://www.szlcsc.com/product/details_18165.html; Package: 0805; Supplier: LC; SuppliersPartNumber: C17477

## Sheet Printer.SchDoc
size A4
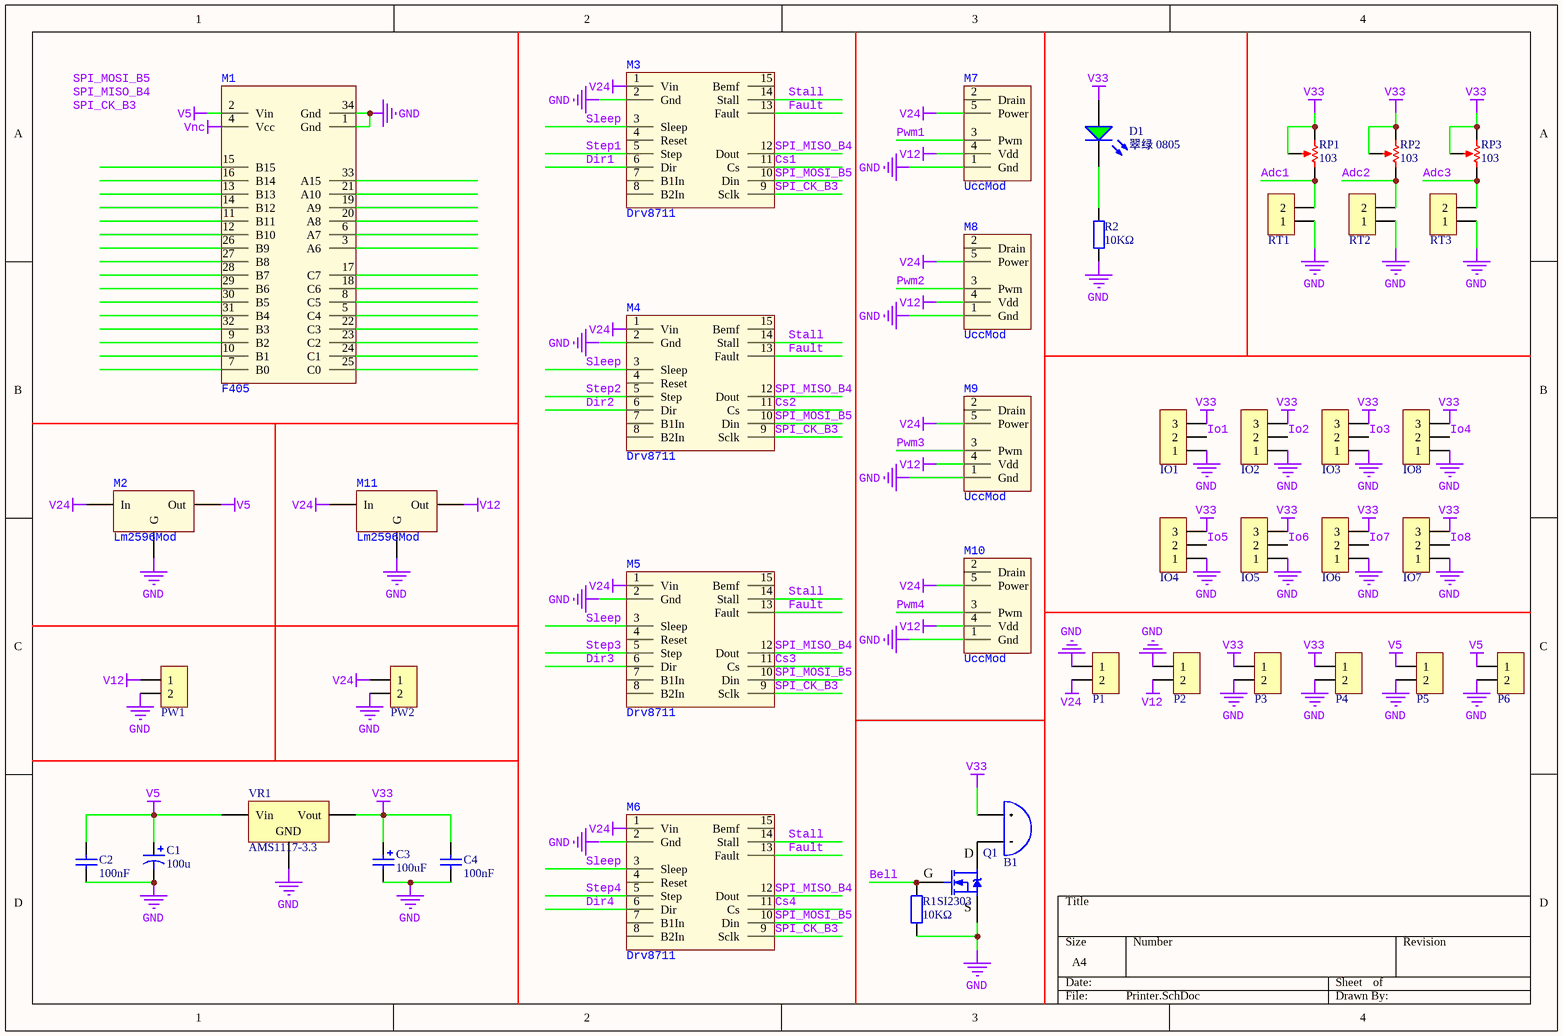
[diagram p15: Printer.SchDoc]

### Parts
(Parts that share a designator on the sheet are numbered #1, #2 ... from top to bottom, then left to right.)
B1#2  Bell  [BELL11.9]  (value not drawn)
C1#10  100u  [CM D(6.3*7.7)]
C2#11  100nF  [0805_C]
C3#10  100uF  [CASE-B_3528]
C4#9  100nF  [0805_C]
D1#8  翠绿 0805  [0805_LED_S1]
IO1  HDR-1X3  [XH2.54-LI-3P]  (value not drawn)
IO2  HDR-1X3  [XH2.54-LI-3P]  (value not drawn)
IO3  HDR-1X3  [XH2.54-LI-3P]  (value not drawn)
IO4  HDR-1X3  [XH2.54-LI-3P]  (value not drawn)
IO5  HDR-1X3  [XH2.54-LI-3P]  (value not drawn)
IO6  HDR-1X3  [XH2.54-LI-3P]  (value not drawn)
IO7  HDR-1X3  [XH2.54-LI-3P]  (value not drawn)
IO8  HDR-1X3  [XH2.54-LI-3P]  (value not drawn)
M1#3  F405  [F405R]
M2#2  Lm2596Mod  [DcDc]
M3#2  Drv8711  [Drv8711Mod]
M4#2  Drv8711  [Drv8711Mod]
M5#2  Drv8711  [Drv8711Mod]
M6#3  Drv8711  [Drv8711Mod]
M7#2  UccMod  [UccMod]
M8  UccMod  [UccMod]
M9  UccMod  [UccMod]
M10  UccMod  [UccMod]
M11  Lm2596Mod  [DcDc]
P1#9  HDR-1X2  [XH2.54-LI-2P]  (value not drawn)
P2#4  HDR-1X2  [XH2.54-LI-2P]  (value not drawn)
P3#4  HDR-1X2  [XH2.54-LI-2P]  (value not drawn)
P4#4  HDR-1X2  [XH2.54-LI-2P]  (value not drawn)
P5#3  HDR-1X2  [XH2.54-LI-2P]  (value not drawn)
P6  HDR-1X2  [XH2.54-LI-2P]  (value not drawn)
PW1  HDR-1X2  [2PIN-5.08A]  (value not drawn)
PW2  HDR-1X2  [2PIN-5.08A]  (value not drawn)
Q1#3  SI2303  [SI2302]
R1#11  10KΩ  [0805_R]
R2#9  10KΩ  [0805_R]
RP1#2  103  [RP3362P]
RP2  103  [RP3362P]
RP3  103  [RP3362P]
RT1  HDR-1X2  [XH2.54-LI-2P]  (value not drawn)
RT2  HDR-1X2  [XH2.54-LI-2P]  (value not drawn)
RT3  HDR-1X2  [XH2.54-LI-2P]  (value not drawn)
VR1#2  AMS1117-3.3  [SOT-223]

### Nets
GND: C1#10.2 C2#11.1 C3#10.2 C4#9.1 IO1.1 IO2.1 IO3.1 IO4.1 IO5.1 IO6.1 IO7.1 IO8.1 M1#3.1(Gnd) M1#3.34(Gnd) M2#2.2(G) M3#2.2(Gnd) M4#2.2(Gnd) M5#2.2(Gnd) M6#3.2(Gnd) M7#2.1(Gnd) M8.1(Gnd) M9.1(Gnd) M10.1(Gnd) M11.2(G) P1#9.1 P2#4.1 P3#4.2 P4#4.2 P5#3.2 P6.2 PW1.2 PW2.2 Q1#3.3(S) R1#11.1 R2#9.1 RT1.1 RT2.1 RT3.1 VR1#2.1(GND)
V5: C1#10.1 C2#11.2 M1#3.2(Vin) M2#2.1(Out) P5#3.1 P6.1 VR1#2.3(Vin)
V12: M7#2.4(Vdd) M8.4(Vdd) M9.4(Vdd) M10.4(Vdd) M11.1(Out) P2#4.2 PW1.1
V24: M2#2.3(In) M3#2.1(Vin) M4#2.1(Vin) M5#2.1(Vin) M6#3.1(Vin) M7#2.5(Power) M8.5(Power) M9.5(Power) M10.5(Power) M11.3(In) P1#9.2 PW2.1
V33: B1#2.1(A) C3#10.1 C4#9.2 D1#8.A IO1.3 IO2.3 IO3.3 IO4.3 IO5.3 IO6.3 IO7.3 IO8.3 P3#4.1 P4#4.1 RP1#2.2(TAP) RP1#2.3(TOP) RP2.2(TAP) RP2.3(TOP) RP3.2(TAP) RP3.3(TOP) VR1#2.2(Vout)
Vnc: M1#3.4(Vcc)
Adc1: RP1#2.1(BOT) RT1.2
Adc2: RP2.1(BOT) RT2.2
Adc3: RP3.1(BOT) RT3.2
Bell: Q1#3.1(G) R1#11.2
Cs1: M3#2.11(Cs)
Cs2: M4#2.11(Cs)
Cs3: M5#2.11(Cs)
Cs4: M6#3.11(Cs)
Dir1: M3#2.6(Dir)
Dir2: M4#2.6(Dir)
Dir3: M5#2.6(Dir)
Dir4: M6#3.6(Dir)
Fault: M3#2.13(Fault) M4#2.13(Fault) M5#2.13(Fault) M6#3.13(Fault)
Io1: IO1.2
Io2: IO2.2
Io3: IO3.2
Io4: IO8.2
Io5: IO4.2
Io6: IO5.2
Io7: IO6.2
Io8: IO7.2
Pwm1: M7#2.3(Pwm)
Pwm2: M8.3(Pwm)
Pwm3: M9.3(Pwm)
Pwm4: M10.3(Pwm)
Sleep: M3#2.3(Sleep) M4#2.3(Sleep) M5#2.3(Sleep) M6#3.3(Sleep)
SPI_CK_B3: M3#2.9(Sclk) M4#2.9(Sclk) M5#2.9(Sclk) M6#3.9(Sclk)
SPI_MISO_B4: M3#2.12(Dout) M4#2.12(Dout) M5#2.12(Dout) M6#3.12(Dout)
SPI_MOSI_B5: M3#2.10(Din) M4#2.10(Din) M5#2.10(Din) M6#3.10(Din)
Stall: M3#2.14(Stall) M4#2.14(Stall) M5#2.14(Stall) M6#3.14(Stall)
Step1: M3#2.5(Step)
Step2: M4#2.5(Step)
Step3: M5#2.5(Step)
Step4: M6#3.5(Step)
NetB1#2_2: B1#2.2(B) Q1#3.2(D)
NetD1#8_K: D1#8.K R2#9.2

Not connected (* = marked no-connect by the designer): M1#3 3(A6) 5(C4) 6(A7) 7(B0) 8(C5) 9(B2) 10(B1) 11(B11) 12(B10) 13(B13) 14(B12) 15(B15) 16(B14) 17(C7) 18(C6) 19(A9) 20(A8) 21(A10) 22(C3) 23(C2) 24(C1) 25(C0) 26(B9) 27(B8) 28(B7) 29(B6) 30(B5) 31(B4) 32(B3) 33(A15); M3#2 4(Reset) 7(B1In) 8(B2In) 15(Bemf); M4#2 4(Reset) 7(B1In) 8(B2In) 15(Bemf); M5#2 4(Reset) 7(B1In) 8(B2In) 15(Bemf); M6#3 4(Reset) 7(B1In) 8(B2In) 15(Bemf); M7#2 2(Drain); M8 2(Drain); M9 2(Drain); M10 2(Drain)

### Notes on the sheet
- Labels drawn without touching a wire or pin: SPI_CK_B3, SPI_MISO_B4, SPI_MOSI_B5

### Library data of the parts
B1#2 = Bell: 蜂鸣器
C1#10 = Cp: Polarized Capacitor (Axial); Published: 8-Jun-2000; LatestRevisionDate: 17-Jul-2002; LatestRevisionNote: Re-released for DXP Platform.; PackageReference: POLAR0.8; Publisher: Altium Limited; PackageDescription: Polarized Capacitor; 2 Leads
C2#11 C4#9 = 0805 100nF(104) 10% 50V: 贴片电容; ComponentLink1Description: 供应商链接; ComponentLink1URL: http://www.szlcsc.com/product/details_50686.html; Package: 0805; Supplier: LC; SuppliersPartNumber: C49678
C3#10 = 3528 100uF (107) 10% 6.3V: 钽电容; ComponentLink1Description: 供应商链接; ComponentLink1URL: http://www.szlcsc.com/product/details_16815.html; Package: 3528; Supplier: LC; SuppliersPartNumber: C16133
D1#8 = 0805 翠绿: 发光二极管; ComponentLink1Description: 供应商链接; ComponentLink1URL: http://www.szlcsc.com/product/details_2670.html; Package: 0805; Supplier: LC; SuppliersPartNumber: C2297
IO1-IO8 = Header 3: 3P接插件; 版权归属: 源创客; BOM名称: 3P接插件; 学习资源: www.ooocke.com
M1#3 = F405R
M2#2 M11 = DcDc
M3#2 M4#2 M5#2 M6#3 = Drv8711Mod
P1#9 P2#4 P3#4 P4#4 P5#3 P6 PW1 PW2 RT1-RT3 = Header 2: 2P接插件; 版权归属: 源创客; BOM名称: 2P接插件; 学习资源: www.ooocke.com
Q1#3 = NMOS: N沟场效应管; 版权归属: 源创客; BOM名称: N沟场效应管; 学习资源: www.ooocke.com
R1#11 R2#9 = 0805 10KΩ (1002) 1%: 贴片电阻; ComponentLink1Description: 供应商链接; ComponentLink1URL: http://www.szlcsc.com/product/details_18102.html; Package: 0805; Supplier: LC; SuppliersPartNumber: C17414
RP1#2 RP2 RP3 = Rp: as R1#10 on sheet Opa365Mod; Published: 8-Jun-2000; LatestRevisionDate: 17-Jul-2002; LatestRevisionNote: Re-released for DXP Platform.; PackageReference: VR5; Publisher: Altium Limited; PackageDescription: Variable Resistor, Thru-Hole; 3 Leads
VR1#2 = SOT-223 AMS1117-3.3: 低压差线性稳压(LDO); ComponentLink1Description: 供应商链接; ComponentLink1URL: http://www.szlcsc.com/product/details_6652.html; Package: SOT-223; Supplier: LC; SuppliersPartNumber: C6186

## Nets that join several sheets
GND: PL2303EVM (8 pins), RT8065 (9 pins), FxxVx (24 pins), FxxZx (49 pins), Stlink (25 pins), ArmPcb (99 pins), ST_All (30 pins), DRV8313EVM (26 pins), MPU6050EVM (23 pins), LM2596MOD (9 pins), MainCtrl (40 pins), DRV8711MOD (13 pins), UCCMod (Q1#2.3 U1#10.4 U1#10.5), Opa365Mod (R4#7.2 R5#6.1 U1#11.4), Printer (39 pins)
V3: DRV8313EVM (8 pins), MPU6050EVM (C3#7.1 C4#7.1)
V5: DRV8313EVM (5 pins), MPU6050EVM (6 pins), Printer (7 pins)
VA: DRV8313EVM (11 pins), MPU6050EVM (16 pins)
VCC: RT8065 (C1#2.2 U1#2.3 U1#2.4 U2#2.1), FxxVx (18 pins), FxxZx (43 pins), ArmPcb (58 pins), MainCtrl (29 pins), Opa365Mod (U1#11.7)
Vin: FxxVx (C16#1.2 U2#3.3), FxxZx (8 pins), ArmPcb (21 pins), DRV8313EVM (6 pins), LM2596MOD (C1#8.1 P1#4.1 U1#8.1), MainCtrl (8 pins), DRV8711MOD (8 pins)